# Altium project 驱动_PCB_Project1.PrjPCB
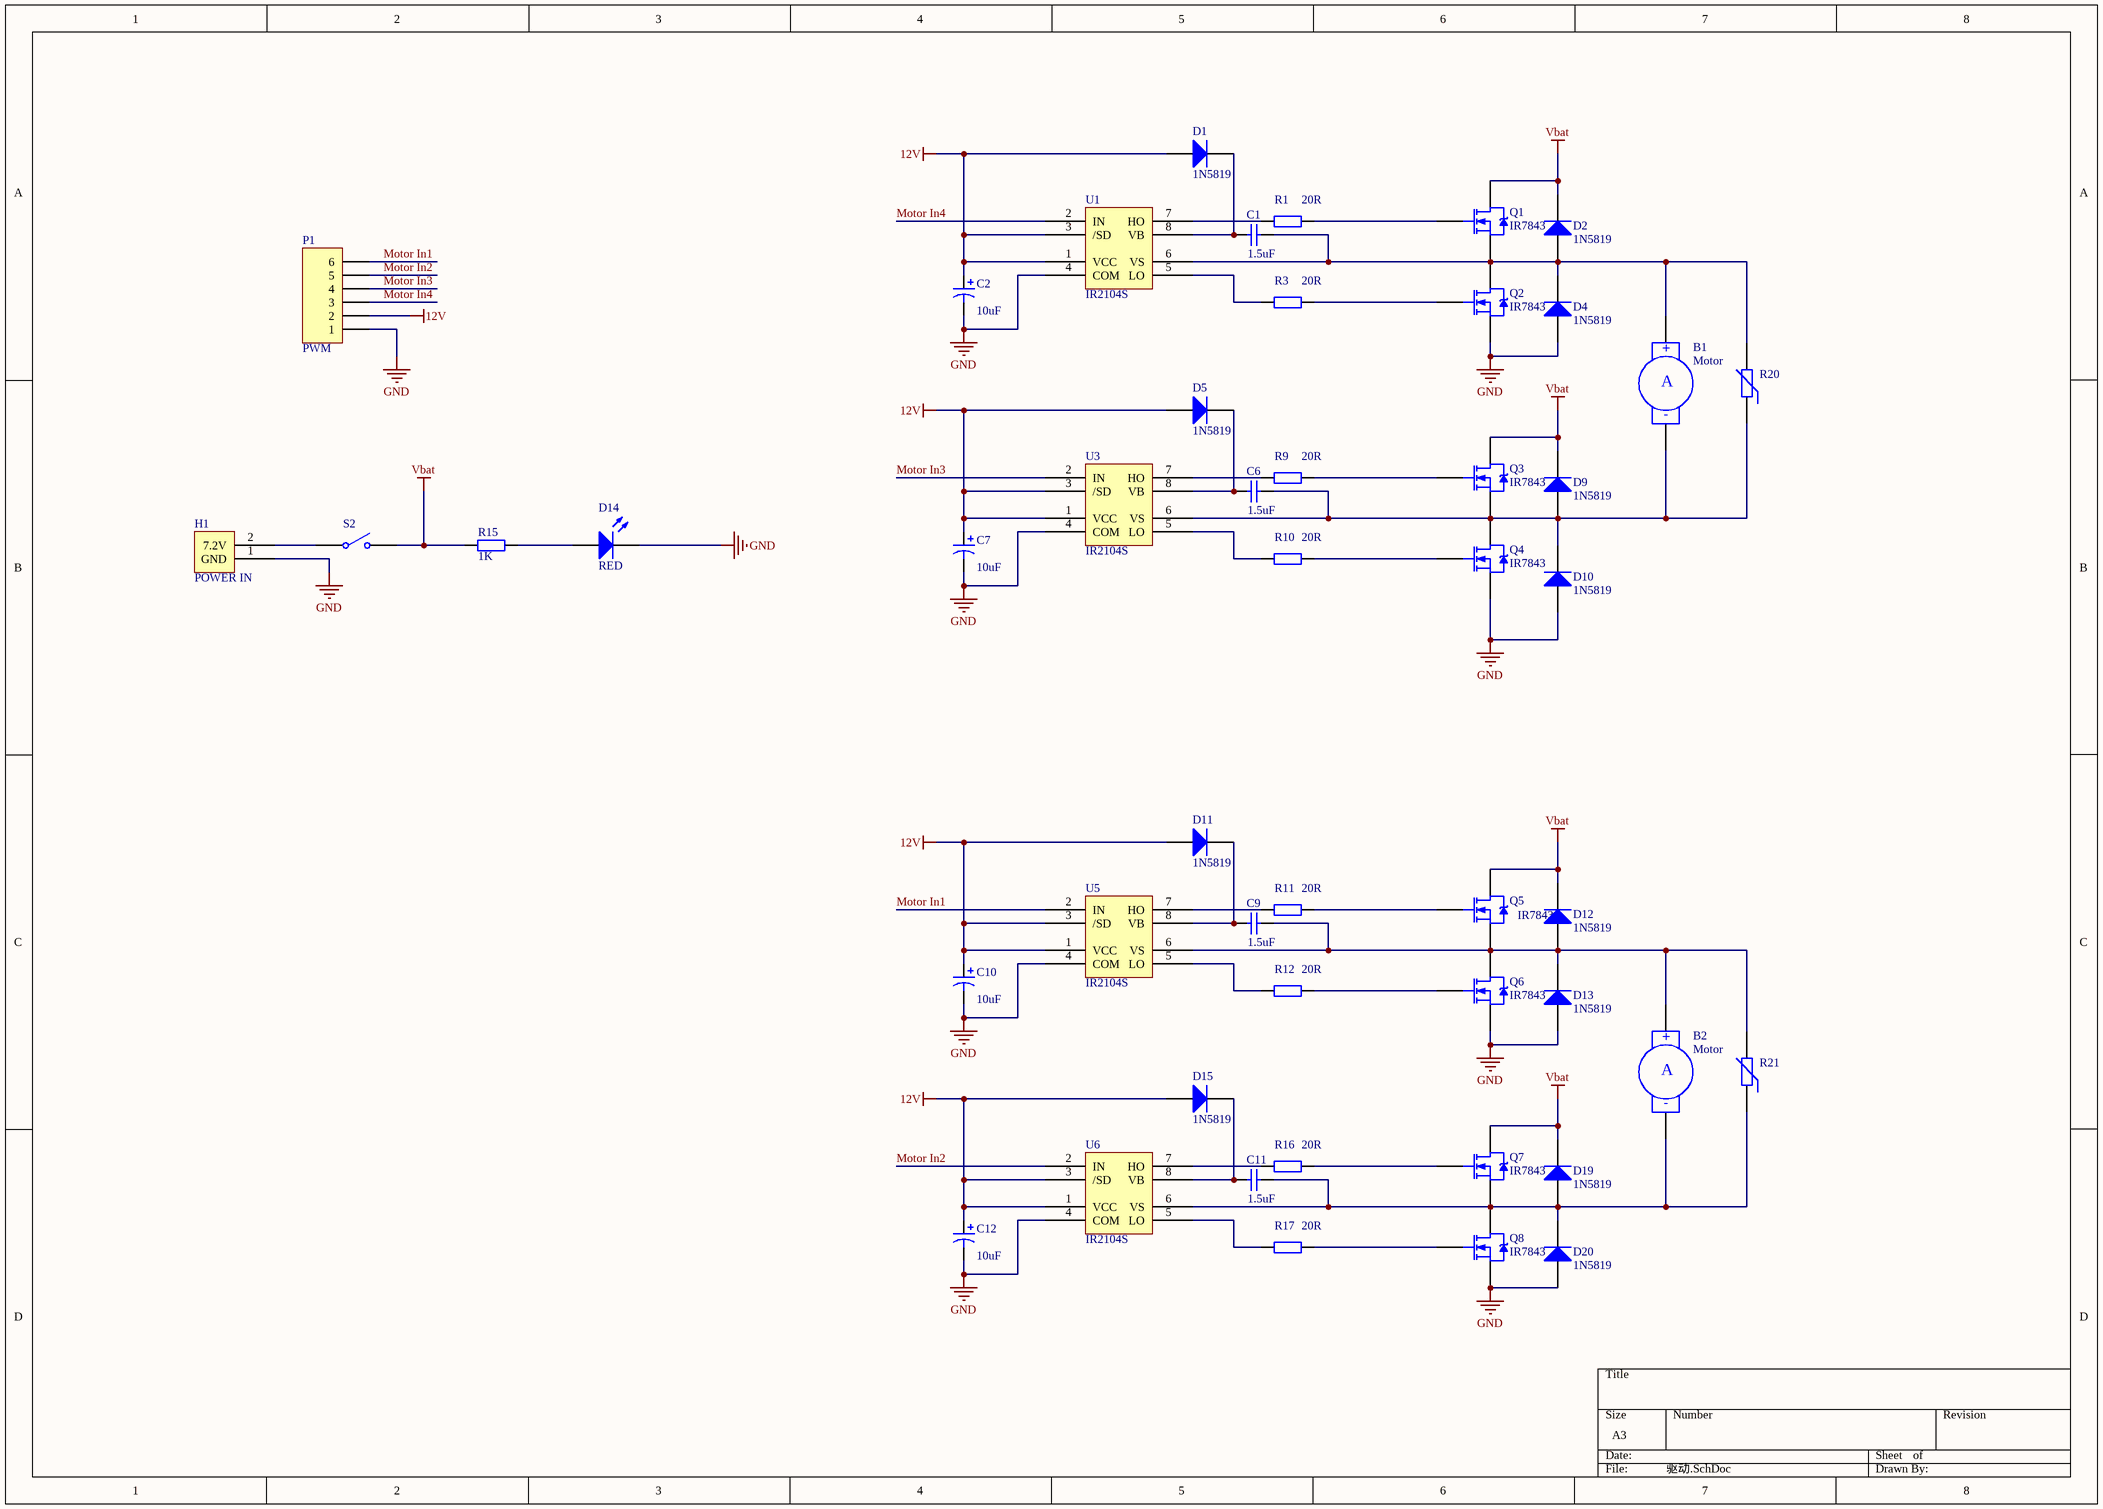
[diagram p0: 驱动.SchDoc]
2 sheets, 110 parts. Net scope: global (net labels, ports and power ports of the same name join across sheets).
Board files: 大松PCB1.PcbDoc, wzy_PCB.PcbDoc
Sheets:
  驱动.SchDoc
  wzy_SCH.SchDoc

## Sheet 驱动.SchDoc
size A3

### Parts
(Parts that share a designator on the sheet are numbered #1, #2 ... from top to bottom, then left to right.)
B1#1  Motor  [KF301-2P]
B2#1  Motor  [KF301-2P]
C1#1  value 1.5uF  [0805(2012)]  (hidden comment: Cap)
C2#1  value 10uF  [SOD-323(0805)]  (hidden comment: Cap Pol1)
C6#1  value 1.5uF  [0805(2012)]  (hidden comment: Cap)
C7#1  value 10uF  [SOD-323(0805)]  (hidden comment: Cap Pol1)
C9#1  value 1.5uF  [0805(2012)]  (hidden comment: Cap)
C10#1  value 10uF  [SOD-323(0805)]  (hidden comment: Cap Pol1)
C11#1  value 1.5uF  [0805(2012)]  (hidden comment: Cap)
C12#1  value 10uF  [SOD-323(0805)]  (hidden comment: Cap Pol1)
D1#1  1N5819  [0805(2012)]
D2#1  1N5819  [0805(2012)]
D4#1  1N5819  [0805(2012)]
D5#1  1N5819  [0805(2012)]
D9#1  1N5819  [0805(2012)]
D10#1  1N5819  [0805(2012)]
D11#1  1N5819  [0805(2012)]
D12#1  1N5819  [0805(2012)]
D13#1  1N5819  [0805(2012)]
D14#1  RED  [0805LED]
D15#1  1N5819  [0805(2012)]
D19#1  1N5819  [0805(2012)]
D20#1  1N5819  [0805(2012)]
H1#1  POWER IN  [KF301-2P]
P1#1  PWM  [HDR1X6]
Q1#1  IR7843  [LR7843]
Q2#1  IR7843  [LR7843]
Q3#1  IR7843  [LR7843]
Q4#1  IR7843  [LR7843]
Q5#1  IR7843  [LR7843]
Q6#1  IR7843  [LR7843]
Q7#1  IR7843  [LR7843]
Q8#1  IR7843  [LR7843]
R1#1  value 20R  [0805(2012)]  (hidden comment: Res2)
R3#1  value 20R  [0805(2012)]  (hidden comment: Res2)
R9#1  value 20R  [0805(2012)]  (hidden comment: Res2)
R10#1  value 20R  [0805(2012)]  (hidden comment: Res2)
R11#1  value 20R  [0805(2012)]  (hidden comment: Res2)
R12#1  value 20R  [0805(2012)]  (hidden comment: Res2)
R15#1  value 1K  [0805(2012)]  (hidden comment: Res2)
R16#1  value 20R  [0805(2012)]  (hidden comment: Res2)
R17#1  value 20R  [0805(2012)]  (hidden comment: Res2)
R20#1  Res Varistor  [0805]  (value not drawn)
R21#1  Res Varistor  [0805]  (value not drawn)
S2#1  zk  [SWITCH]  (value not drawn)
U1#1  IR2104S  [IR2104S]
U3#1  IR2104S  [IR2104S]
U5#1  IR2104S  [IR2104S]
U6#1  IR2104S  [IR2104S]

### Nets
12V: C2#1.1 C7#1.1 C10#1.1 C12#1.1 D1#1.2(A) D5#1.2(A) D11#1.2(A) D15#1.2(A) P1#1.2 U1#1.1(VCC) U1#1.3(/SD) U3#1.1(VCC) U3#1.3(/SD) U5#1.1(VCC) U5#1.3(/SD) U6#1.1(VCC) U6#1.3(/SD)
GND: C2#1.2 C7#1.2 C10#1.2 C12#1.2 D4#1.2(A) D10#1.2(A) D13#1.2(A) D14#1.2(K) D20#1.2(A) H1#1.1(GND) P1#1.1 Q2#1.3(S) Q4#1.3(S) Q6#1.3(S) Q8#1.3(S) U1#1.4(COM) U3#1.4(COM) U5#1.4(COM) U6#1.4(COM)
Vbat: D2#1.1(K) D9#1.1(K) D12#1.1(K) D19#1.1(K) Q1#1.2(D) Q3#1.2(D) Q5#1.2(D) Q7#1.2(D) R15#1.1 S2#1.2(NO)
Motor In1: P1#1.6 U5#1.2(IN)
Motor In2: P1#1.5 U6#1.2(IN)
Motor In3: P1#1.4 U3#1.2(IN)
Motor In4: P1#1.3 U1#1.2(IN)
NetB1#1_1: B1#1.1(+) C1#1.2 D2#1.2(A) D4#1.1(K) Q1#1.3(S) Q2#1.2(D) R20#1.2 U1#1.6(VS)
NetB1#1_2: B1#1.2(-) C6#1.2 D9#1.2(A) D10#1.1(K) Q3#1.3(S) Q4#1.2(D) R20#1.1 U3#1.6(VS)
NetB2#1_1: B2#1.1(+) C9#1.2 D12#1.2(A) D13#1.1(K) Q5#1.3(S) Q6#1.2(D) R21#1.2 U5#1.6(VS)
NetB2#1_2: B2#1.2(-) C11#1.2 D19#1.2(A) D20#1.1(K) Q7#1.3(S) Q8#1.2(D) R21#1.1 U6#1.6(VS)
NetC1#1_1: C1#1.1 D1#1.1(K) U1#1.8(VB)
NetC6#1_1: C6#1.1 D5#1.1(K) U3#1.8(VB)
NetC9#1_1: C9#1.1 D11#1.1(K) U5#1.8(VB)
NetC11#1_1: C11#1.1 D15#1.1(K) U6#1.8(VB)
NetD14#1_1: D14#1.1(A) R15#1.2
NetH1#1_2: H1#1.2(7.2V) S2#1.1(COMMON)
NetQ1#1_1: Q1#1.1(G) R1#1.2
NetQ2#1_1: Q2#1.1(G) R3#1.2
NetQ3#1_1: Q3#1.1(G) R9#1.2
NetQ4#1_1: Q4#1.1(G) R10#1.2
NetQ5#1_1: Q5#1.1(G) R11#1.2
NetQ6#1_1: Q6#1.1(G) R12#1.2
NetQ7#1_1: Q7#1.1(G) R16#1.2
NetQ8#1_1: Q8#1.1(G) R17#1.2
NetR1#1_1: R1#1.1 U1#1.7(HO)
NetR3#1_1: R3#1.1 U1#1.5(LO)
NetR9#1_1: R9#1.1 U3#1.7(HO)
NetR10#1_1: R10#1.1 U3#1.5(LO)
NetR11#1_1: R11#1.1 U5#1.7(HO)
NetR12#1_1: R12#1.1 U5#1.5(LO)
NetR16#1_1: R16#1.1 U6#1.7(HO)
NetR17#1_1: R17#1.1 U6#1.5(LO)

### Notes on the sheet
- (in symbol Motor Servo) A

### Library data of the parts
B1#1 B2#1 = Motor Servo: Servo Motor; Published: 24-Mar-1999; LatestRevisionDate: 17-Jul-2002; LatestRevisionNote: Re-released for DXP Platform.; PackageReference: RAD-0.4; Publisher: Altium Limited; PackageDescription: Radial Cap, Thru-Hole; 2 Leads; 0.4 in Pin Spacing
C1#1 C6#1 C9#1 C11#1 = Cap: Capacitor; Published: 8-Jun-2000; LatestRevisionDate: 17-Jul-2002; LatestRevisionNote: Re-released for DXP Platform.; PackageReference: RAD-0.3; Publisher: Altium Limited; PackageDescription: Radial Cap, Thru-Hole; 2 Leads; 0.3 in Pin Spacing
C2#1 C7#1 C10#1 C12#1 = Cap Pol1: Polarized Capacitor (Radial); Published: 8-Jun-2000; LatestRevisionDate: 17-Jul-2002; LatestRevisionNote: Re-released for DXP Platform.; PackageReference: RB7.6-15; Publisher: Altium Limited; PackageDescription: Polarized Capacitor (Radial); 2 Leads
D1#1 D2#1 D4#1 D5#1 D9#1 D10#1 D11#1 D12#1 D13#1 D15#1 D19#1 D20#1 = 1N4148: Silicon Epitaxial Planar Diode for Various Detector, Modulator, Demodulator; Published: 12-Feb-2010; DatasheetVersion: Rev.5.00, Jul-2006; PackageVersion: Aug-2005; PackageReference: GRZZ0002ZB-A; Publisher: Altium Limited; PackageDescription: Diode, Axial; Body 4.2 x 2.0 mm (LxDia.), Lead Dia. 0.5 mm (nom); Code_JEITA: SC-40; ComponentLink1Description: Manufacturer Link; ComponentLink1URL: http://sg.renesas.com/fmwk.jsp?cnt=diode_landing.jsp&fp=/products/discrete/diodes/; ComponentLink2Description: Datasheet; ComponentLink2URL: http://documentation.renesas.com/eng/products/diode/rej03g0556_1n4148.pdf; ComponentLink3Description: Packaging Specification; ComponentLink3URL: http://sg.renesas.com/media/products/common_info/package/pdf/diode/code/grzz0002zb_a.pdf
D14#1 = LED2: Typical RED, GREEN, YELLOW, AMBER GaAs LED; Published: 8-Jun-2000; LatestRevisionDate: 17-Jul-2002; LatestRevisionNote: Re-released for DXP Platform.; PackageVersion: Feb-2002; PackageReference: 3.2X1.6X1.1; Publisher: Altium Limited; PackageDescription: SM LED; 2 Flat Leads
P1#1 = Header 6: Header, 6-Pin; LatestRevisionDate: 17-Jul-2002; LatestRevisionNote: Re-released for DXP Platform.; Publisher: Altium Limited
Q1#1 Q2#1 Q3#1 Q4#1 Q5#1 Q6#1 Q7#1 Q8#1 = IR7843: N-Channel Power MOSFET; Note: Pin 2 is electrically connected to pin 4.; Published: 8-Jun-2000; LatestRevisionDate: 17-Jul-2002; LatestRevisionNote: Re-released for DXP Platform.; DatasheetVersion: PD-9.814; PackageVersion: Feb-1997; PackageReference: TO-220AB; Publisher: Altium Limited; PackageDescription: TO, Thru-Hole, Vertical, Heatsink Mounted; 3 In-Line Leads; Pitch 2.54 mm; ComponentLink1Description: Manufacturer Link; ComponentLink1URL: http://www.irf.com/
R1#1 R3#1 R9#1 R10#1 R11#1 R12#1 R15#1 R16#1 R17#1 = Res2: Resistor; Published: 8-Jun-2000; LatestRevisionDate: 17-Jul-2002; LatestRevisionNote: Re-released for DXP Platform.; PackageReference: AXIAL-0.4; Publisher: Altium Limited; PackageDescription: Axial Device, Thru-Hole; 2 Leads; 0.4 in Pin Spacing
R20#1 R21#1 = Res Varistor: Varistor (Voltage-Sensitive Resistor); Published: 24-Mar-1999; LatestRevisionDate: 29-May-2009; LatestRevisionNote: IPC-7351 Footprint Added.; PackageVersion: Mar-2003; PackageReference: 6-0805; Publisher: Altium Limited; PackageDescription: Chip Resistor 0805 Case Size; Code_IPC: RESC2012
S2#1 = SW-SPST: Single-Pole, Single-Throw Switch; Published: 24-Mar-1999; LatestRevisionDate: 17-Jul-2002; LatestRevisionNote: Re-released for DXP Platform.; PackageReference: SPST-2; Publisher: Altium Limited; PackageDescription: Switch; 2 Leads

## Sheet wzy_SCH.SchDoc
size A3
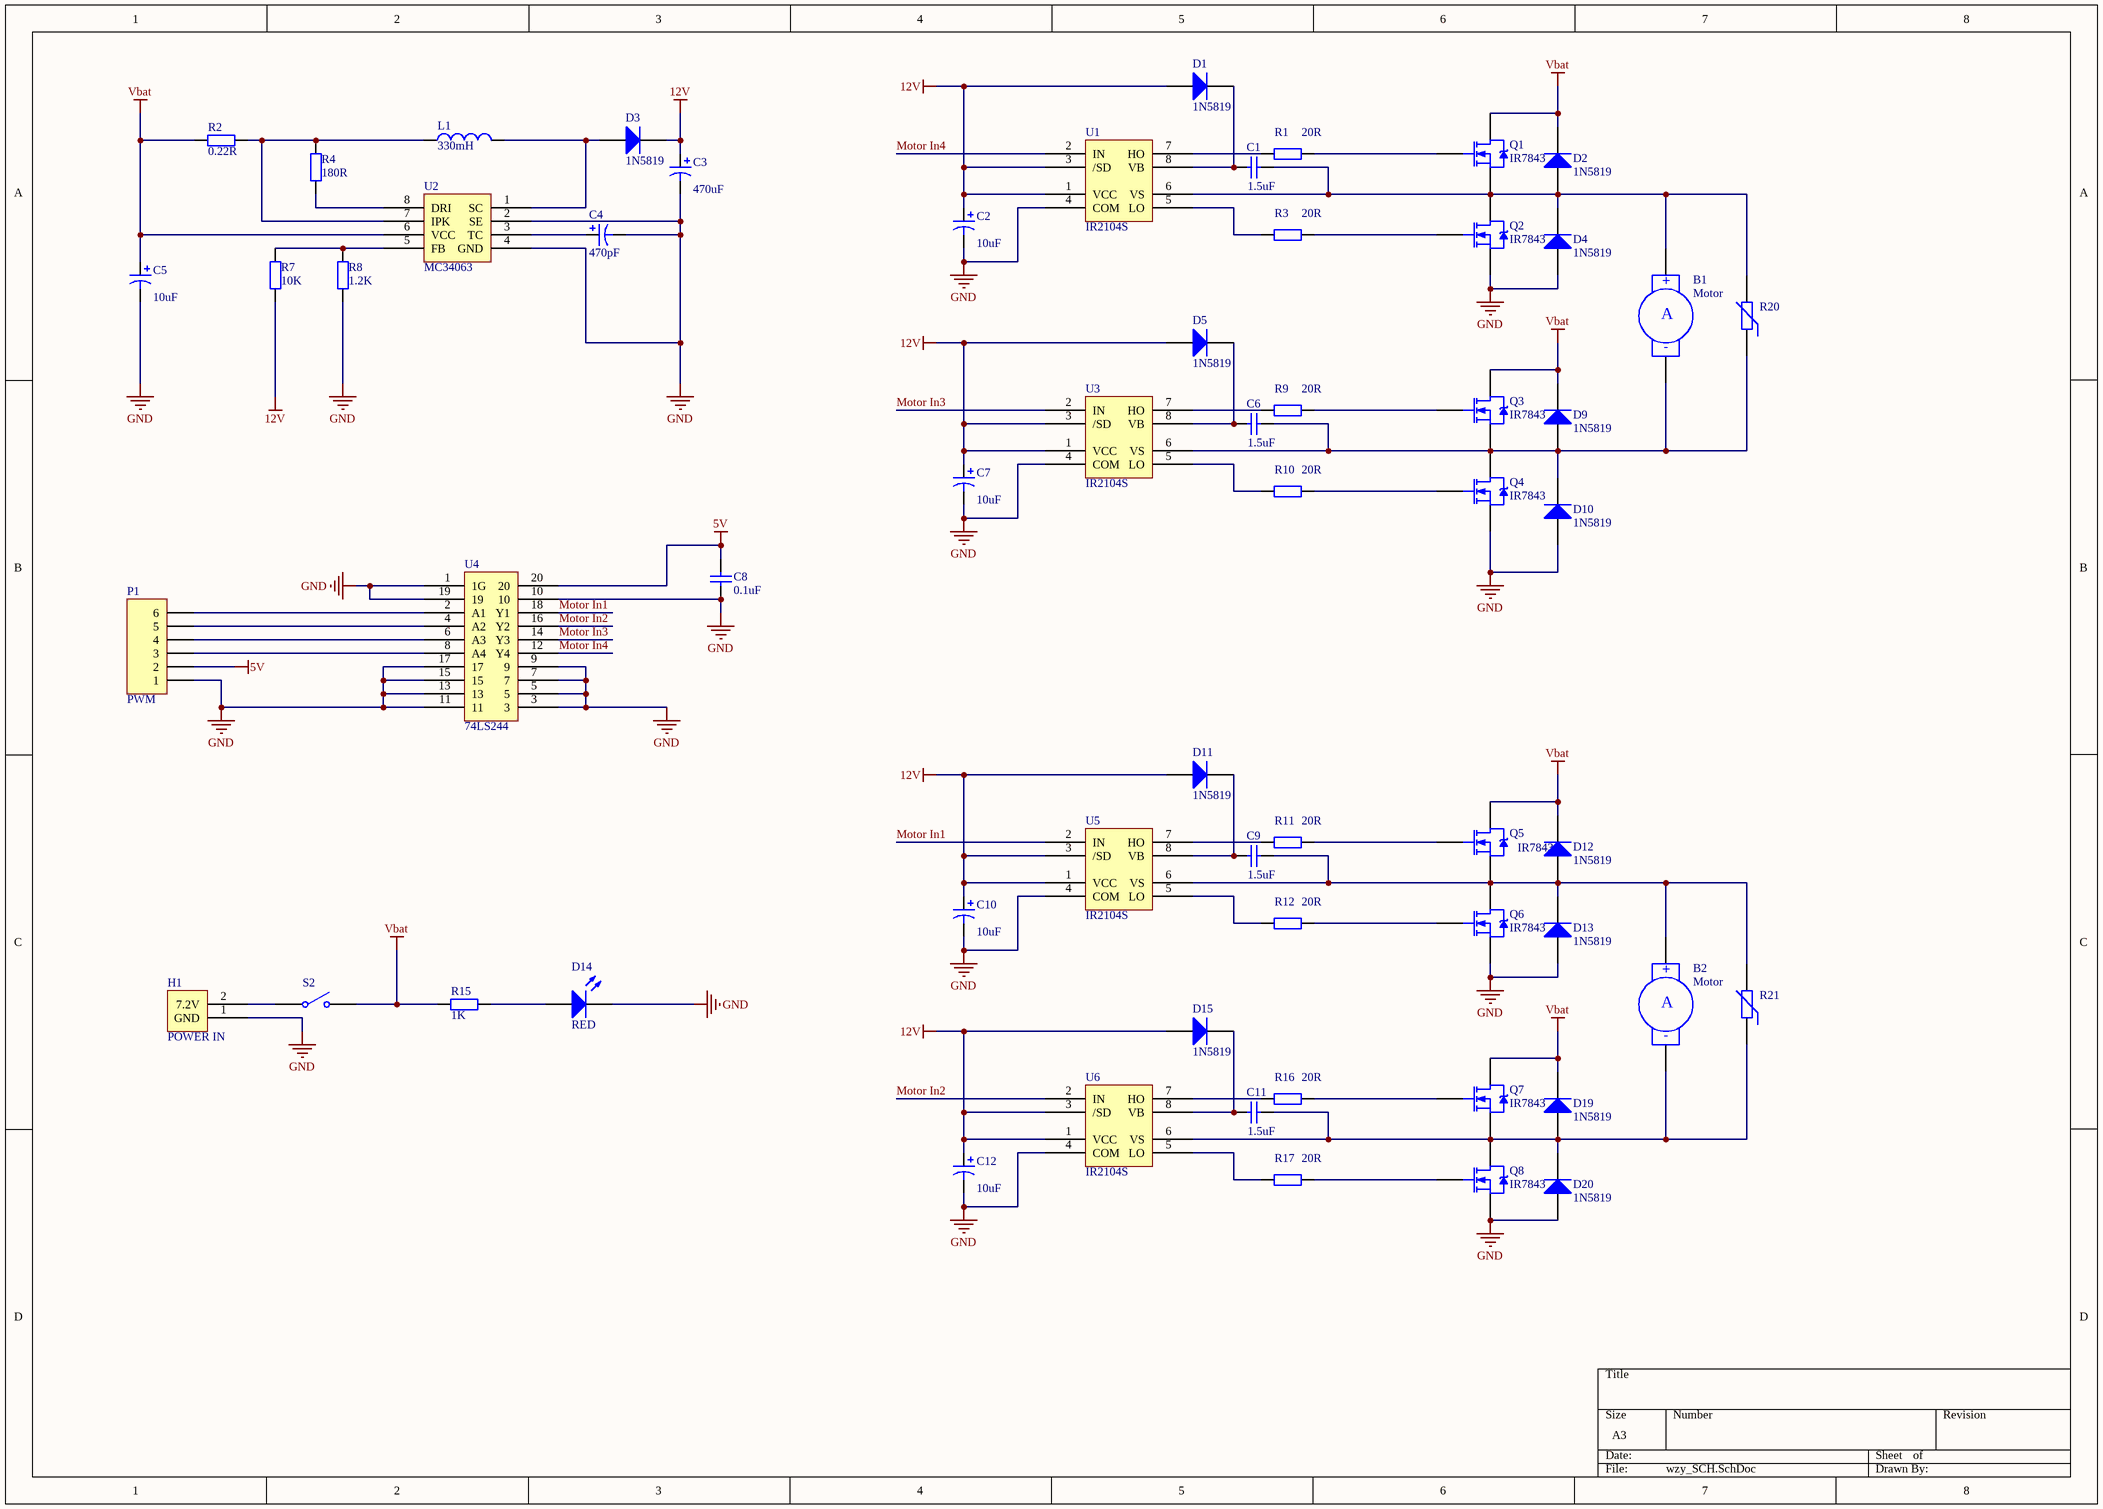
[diagram p1: wzy_SCH.SchDoc]

### Parts
(Parts that share a designator on the sheet are numbered #1, #2 ... from top to bottom, then left to right.)
B1#2  Motor  [KF301-2P]
B2#2  Motor  [KF301-2P]
C1#2  value 1.5uF  [0805(2012)]  (hidden comment: Cap)
C2#2  value 10uF  [SOD-323(0805)]  (hidden comment: Cap Pol1)
C3  value 470uF  [RB5-10.5]  (hidden comment: Cap Pol1)
C4  value 470pF  [SOD-323(0805)]  (hidden comment: Cap Pol1)
C5  value 10uF  [SOD-323(0805)]  (hidden comment: Cap Pol1)
C6#2  value 1.5uF  [0805(2012)]  (hidden comment: Cap)
C7#2  value 10uF  [SOD-323(0805)]  (hidden comment: Cap Pol1)
C8  value 0.1uF  [0805(2012)]  (hidden comment: Cap)
C9#2  value 1.5uF  [0805(2012)]  (hidden comment: Cap)
C10#2  value 10uF  [SOD-323(0805)]  (hidden comment: Cap Pol1)
C11#2  value 1.5uF  [0805(2012)]  (hidden comment: Cap)
C12#2  value 10uF  [SOD-323(0805)]  (hidden comment: Cap Pol1)
D1#2  1N5819  [0805(2012)]
D2#2  1N5819  [0805(2012)]
D3  1N5819  [0805(2012)]
D4#2  1N5819  [0805(2012)]
D5#2  1N5819  [0805(2012)]
D9#2  1N5819  [0805(2012)]
D10#2  1N5819  [0805(2012)]
D11#2  1N5819  [0805(2012)]
D12#2  1N5819  [0805(2012)]
D13#2  1N5819  [0805(2012)]
D14#2  RED  [0805LED]
D15#2  1N5819  [0805(2012)]
D19#2  1N5819  [0805(2012)]
D20#2  1N5819  [0805(2012)]
H1#2  POWER IN  [KF301-2P]
L1  value 330mH  [电感10*12]  (hidden comment: Inductor)
P1#2  PWM  [HDR1X6]
Q1#2  IR7843  [LR7843]
Q2#2  IR7843  [LR7843]
Q3#2  IR7843  [LR7843]
Q4#2  IR7843  [LR7843]
Q5#2  IR7843  [LR7843]
Q6#2  IR7843  [LR7843]
Q7#2  IR7843  [LR7843]
Q8#2  IR7843  [LR7843]
R1#2  value 20R  [0805(2012)]  (hidden comment: Res2)
R2  value 0.22R  [1206(3216)]  (hidden comment: Res2)
R3#2  value 20R  [0805(2012)]  (hidden comment: Res2)
R4  value 180R  [0805(2012)]  (hidden comment: Res2)
R7  value 10K  [0805(2012)]  (hidden comment: Res2)
R8  value 1.2K  [0805(2012)]  (hidden comment: Res2)
R9#2  value 20R  [0805(2012)]  (hidden comment: Res2)
R10#2  value 20R  [0805(2012)]  (hidden comment: Res2)
R11#2  value 20R  [0805(2012)]  (hidden comment: Res2)
R12#2  value 20R  [0805(2012)]  (hidden comment: Res2)
R15#2  value 1K  [0805(2012)]  (hidden comment: Res2)
R16#2  value 20R  [0805(2012)]  (hidden comment: Res2)
R17#2  value 20R  [0805(2012)]  (hidden comment: Res2)
R20#2  Res Varistor  [0805]  (value not drawn)
R21#2  Res Varistor  [0805]  (value not drawn)
S2#2  zk  [SWITCH]  (value not drawn)
U1#2  IR2104S  [IR2104S]
U2  MC34063  [MC34063]
U3#2  IR2104S  [IR2104S]
U4  74LS244  [74ls244DA]
U5#2  IR2104S  [IR2104S]
U6#2  IR2104S  [IR2104S]

### Nets
5V: C8.2 P1#2.2 U4.20
12V: C2#2.1 C3.1 C7#2.1 C10#2.1 C12#2.1 D1#2.2(A) D3.1(K) D5#2.2(A) D11#2.2(A) D15#2.2(A) R7.1 U1#2.1(VCC) U1#2.3(/SD) U3#2.1(VCC) U3#2.3(/SD) U5#2.1(VCC) U5#2.3(/SD) U6#2.1(VCC) U6#2.3(/SD)
GND: C2#2.2 C3.2 C4.2 C5.2 C7#2.2 C8.1 C10#2.2 C12#2.2 D4#2.2(A) D10#2.2(A) D13#2.2(A) D14#2.2(K) D20#2.2(A) H1#2.1(GND) P1#2.1 Q2#2.3(S) Q4#2.3(S) Q6#2.3(S) Q8#2.3(S) R8.1 U1#2.4(COM) U2.2(SE) U2.4(GND) U3#2.4(COM) U4.1(1G) U4.3 U4.5 U4.7 U4.9 U4.10 U4.11 U4.13 U4.15 U4.17 U4.19 U5#2.4(COM) U6#2.4(COM)
Vbat: C5.1 D2#2.1(K) D9#2.1(K) D12#2.1(K) D19#2.1(K) Q1#2.2(D) Q3#2.2(D) Q5#2.2(D) Q7#2.2(D) R2.2 R15#2.1 S2#2.2(NO) U2.6(VCC)
Motor In1: U4.18(Y1) U5#2.2(IN)
Motor In2: U4.16(Y2) U6#2.2(IN)
Motor In3: U3#2.2(IN) U4.14(Y3)
Motor In4: U1#2.2(IN) U4.12(Y4)
NetB1#2_1: B1#2.1(+) C1#2.2 D2#2.2(A) D4#2.1(K) Q1#2.3(S) Q2#2.2(D) R20#2.2 U1#2.6(VS)
NetB1#2_2: B1#2.2(-) C6#2.2 D9#2.2(A) D10#2.1(K) Q3#2.3(S) Q4#2.2(D) R20#2.1 U3#2.6(VS)
NetB2#2_1: B2#2.1(+) C9#2.2 D12#2.2(A) D13#2.1(K) Q5#2.3(S) Q6#2.2(D) R21#2.2 U5#2.6(VS)
NetB2#2_2: B2#2.2(-) C11#2.2 D19#2.2(A) D20#2.1(K) Q7#2.3(S) Q8#2.2(D) R21#2.1 U6#2.6(VS)
NetC1#2_1: C1#2.1 D1#2.1(K) U1#2.8(VB)
NetC4_1: C4.1 U2.3(TC)
NetC6#2_1: C6#2.1 D5#2.1(K) U3#2.8(VB)
NetC9#2_1: C9#2.1 D11#2.1(K) U5#2.8(VB)
NetC11#2_1: C11#2.1 D15#2.1(K) U6#2.8(VB)
NetD3_2: D3.2(A) L1.2 U2.1(SC)
NetD14#2_1: D14#2.1(A) R15#2.2
NetH1#2_2: H1#2.2(7.2V) S2#2.1(COMMON)
NetL1_1: L1.1 R2.1 R4.2 U2.7(IPK)
NetP1#2_3: P1#2.3 U4.8(A4)
NetP1#2_4: P1#2.4 U4.6(A3)
NetP1#2_5: P1#2.5 U4.4(A2)
NetP1#2_6: P1#2.6 U4.2(A1)
NetQ1#2_1: Q1#2.1(G) R1#2.2
NetQ2#2_1: Q2#2.1(G) R3#2.2
NetQ3#2_1: Q3#2.1(G) R9#2.2
NetQ4#2_1: Q4#2.1(G) R10#2.2
NetQ5#2_1: Q5#2.1(G) R11#2.2
NetQ6#2_1: Q6#2.1(G) R12#2.2
NetQ7#2_1: Q7#2.1(G) R16#2.2
NetQ8#2_1: Q8#2.1(G) R17#2.2
NetR1#2_1: R1#2.1 U1#2.7(HO)
NetR3#2_1: R3#2.1 U1#2.5(LO)
NetR4_1: R4.1 U2.8(DRI)
NetR7_2: R7.2 R8.2 U2.5(FB)
NetR9#2_1: R9#2.1 U3#2.7(HO)
NetR10#2_1: R10#2.1 U3#2.5(LO)
NetR11#2_1: R11#2.1 U5#2.7(HO)
NetR12#2_1: R12#2.1 U5#2.5(LO)
NetR16#2_1: R16#2.1 U6#2.7(HO)
NetR17#2_1: R17#2.1 U6#2.5(LO)

### Notes on the sheet
- (in symbol Motor Servo) A

### Library data of the parts
B1#2 B2#2 = Motor Servo: Servo Motor; Published: 24-Mar-1999; LatestRevisionDate: 17-Jul-2002; LatestRevisionNote: Re-released for DXP Platform.; PackageReference: RAD-0.4; Publisher: Altium Limited; PackageDescription: Radial Cap, Thru-Hole; 2 Leads; 0.4 in Pin Spacing
C1#2 C6#2 C8 C9#2 C11#2 = Cap: Capacitor; Published: 8-Jun-2000; LatestRevisionDate: 17-Jul-2002; LatestRevisionNote: Re-released for DXP Platform.; PackageReference: RAD-0.3; Publisher: Altium Limited; PackageDescription: Radial Cap, Thru-Hole; 2 Leads; 0.3 in Pin Spacing
C2#2 C3-C5 C7#2 C10#2 C12#2 = Cap Pol1: Polarized Capacitor (Radial); Published: 8-Jun-2000; LatestRevisionDate: 17-Jul-2002; LatestRevisionNote: Re-released for DXP Platform.; PackageReference: RB7.6-15; Publisher: Altium Limited; PackageDescription: Polarized Capacitor (Radial); 2 Leads
D1#2 D2#2 D3 D4#2 D5#2 D9#2 D10#2 D11#2 D12#2 D13#2 D15#2 D19#2 D20#2 = 1N4148: as D1#1 on sheet 驱动; Published: 12-Feb-2010; DatasheetVersion: Rev.5.00, Jul-2006; PackageVersion: Aug-2005; PackageReference: GRZZ0002ZB-A; Publisher: Altium Limited; PackageDescription: Diode, Axial; Body 4.2 x 2.0 mm (LxDia.), Lead Dia. 0.5 mm (nom); Code_JEITA: SC-40; ComponentLink1Description: Manufacturer Link; ComponentLink1URL: http://sg.renesas.com/fmwk.jsp?cnt=diode_landing.jsp&fp=/products/discrete/diodes/; ComponentLink2Description: Datasheet; ComponentLink2URL: http://documentation.renesas.com/eng/products/diode/rej03g0556_1n4148.pdf; ComponentLink3Description: Packaging Specification; ComponentLink3URL: http://sg.renesas.com/media/products/common_info/package/pdf/diode/code/grzz0002zb_a.pdf
D14#2 = LED2: as D14#1 on sheet 驱动; Published: 8-Jun-2000; LatestRevisionDate: 17-Jul-2002; LatestRevisionNote: Re-released for DXP Platform.; PackageVersion: Feb-2002; PackageReference: 3.2X1.6X1.1; Publisher: Altium Limited; PackageDescription: SM LED; 2 Flat Leads
L1 = Inductor: Code_IEC: 1005; Published: 8-Jun-2000; LatestRevisionDate: 29-May-2009; LatestRevisionNote: IPC-7351 Footprint Added.; PackageReference: 0402-A; Publisher: Altium Limited; PackageDescription: Chip Inductor; Code_JEITA: 0402
P1#2 = Header 6: Header, 6-Pin; LatestRevisionDate: 17-Jul-2002; LatestRevisionNote: Re-released for DXP Platform.; Publisher: Altium Limited
Q1#2 Q2#2 Q3#2 Q4#2 Q5#2 Q6#2 Q7#2 Q8#2 = IR7843: as Q1#1 on sheet 驱动; Published: 8-Jun-2000; LatestRevisionDate: 17-Jul-2002; LatestRevisionNote: Re-released for DXP Platform.; DatasheetVersion: PD-9.814; PackageVersion: Feb-1997; PackageReference: TO-220AB; Publisher: Altium Limited; PackageDescription: TO, Thru-Hole, Vertical, Heatsink Mounted; 3 In-Line Leads; Pitch 2.54 mm; ComponentLink1Description: Manufacturer Link; ComponentLink1URL: http://www.irf.com/
R1#2 R2 R3#2 R4 R7 R8 R9#2 R10#2 R11#2 R12#2 R15#2 R16#2 R17#2 = Res2: Resistor; Published: 8-Jun-2000; LatestRevisionDate: 17-Jul-2002; LatestRevisionNote: Re-released for DXP Platform.; PackageReference: AXIAL-0.4; Publisher: Altium Limited; PackageDescription: Axial Device, Thru-Hole; 2 Leads; 0.4 in Pin Spacing
R20#2 R21#2 = Res Varistor: Varistor (Voltage-Sensitive Resistor); Published: 24-Mar-1999; LatestRevisionDate: 29-May-2009; LatestRevisionNote: IPC-7351 Footprint Added.; PackageVersion: Mar-2003; PackageReference: 6-0805; Publisher: Altium Limited; PackageDescription: Chip Resistor 0805 Case Size; Code_IPC: RESC2012
S2#2 = SW-SPST: Single-Pole, Single-Throw Switch; Published: 24-Mar-1999; LatestRevisionDate: 17-Jul-2002; LatestRevisionNote: Re-released for DXP Platform.; PackageReference: SPST-2; Publisher: Altium Limited; PackageDescription: Switch; 2 Leads

## Nets that join several sheets
12V: 驱动 (17 pins), wzy_SCH (19 pins)
GND: 驱动 (19 pins), wzy_SCH (37 pins)
Vbat: 驱动 (10 pins), wzy_SCH (13 pins)
Motor In1: 驱动 (P1#1.6 U5#1.2), wzy_SCH (U4.18 U5#2.2)
Motor In2: 驱动 (P1#1.5 U6#1.2), wzy_SCH (U4.16 U6#2.2)
Motor In3: 驱动 (P1#1.4 U3#1.2), wzy_SCH (U3#2.2 U4.14)
Motor In4: 驱动 (P1#1.3 U1#1.2), wzy_SCH (U1#2.2 U4.12)